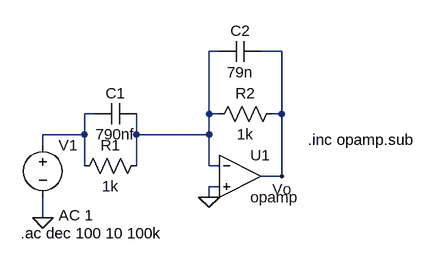
[diagram p0: schematic Draft1.asc]
Draft1.asc, the LTspice schematic file:
Version 4
SHEET 1 880 680
WIRE 224 -32 208 -32
WIRE 320 -32 288 -32
WIRE 32 64 16 64
WIRE 208 64 208 -32
WIRE 224 64 208 64
WIRE 320 64 320 -32
WIRE 320 64 304 64
WIRE 16 96 16 64
WIRE 16 96 -48 96
WIRE 96 96 96 64
WIRE 208 96 208 64
WIRE 208 96 96 96
WIRE -48 112 -48 96
WIRE 16 144 16 96
WIRE 96 144 96 96
WIRE 208 144 208 96
WIRE 224 144 208 144
WIRE 320 160 320 64
WIRE 320 160 288 160
WIRE 224 176 208 176
WIRE 208 192 208 176
WIRE -48 224 -48 192
FLAG 208 192 0
FLAG -48 224 0
FLAG 320 160 Vo
SYMBOL OpAmps\\opamp 256 96 R0
SYMATTR InstName U1
SYMBOL res 112 128 R90
WINDOW 0 0 56 VBottom 2
WINDOW 3 32 56 VTop 2
SYMATTR InstName R1
SYMATTR Value 1k
SYMBOL cap 96 48 R90
WINDOW 0 0 32 VBottom 2
WINDOW 3 32 32 VTop 2
SYMATTR InstName C1
SYMATTR Value 790nf
SYMBOL res 320 48 R90
WINDOW 0 0 56 VBottom 2
WINDOW 3 32 56 VTop 2
SYMATTR InstName R2
SYMATTR Value 1k
SYMBOL cap 288 -48 R90
WINDOW 0 0 32 VBottom 2
WINDOW 3 32 32 VTop 2
SYMATTR InstName C2
SYMATTR Value 79n
SYMBOL voltage -48 96 R0
WINDOW 123 24 124 Left 2
WINDOW 39 0 0 Left 0
SYMATTR InstName V1
SYMATTR Value ""
SYMATTR Value2 AC 1
TEXT -82 248 Left 2 !.ac dec 100 10 100k
TEXT 360 104 Left 2 !.inc opamp.sub

The netlist it stands for:
* Draft1.asc
XU1 N001 0 Vo opamp Aol=100K GBW=10Meg  ; pins invin noninvin out
R1 N001 N002 1k
C1 N001 N002 790nf
R2 Vo N001 1k
C2 Vo N001 79n
V1 N002 0 AC 1
.ac dec 100 10 100k
.inc opamp.sub
.backanno
.end